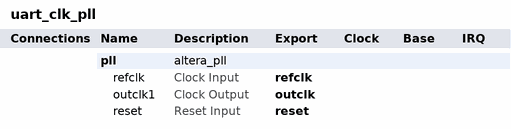
[diagram p0: system contents]
# Platform Designer (Qsys) system uart_clk_pll, Cyclone V 5CGXFC5C6F27C7
# Parameters at their usual value, and those the tool derives, are not listed.
package require -exact qsys 19.1
create_system uart_clk_pll
set_project_property DEVICE_FAMILY {Cyclone V}
set_project_property DEVICE 5CGXFC5C6F27C7

add_instance pll altera_pll 19.1
set_instance_parameter_value pll gui_device_speed_grade 1
set_instance_parameter_value pll gui_en_adv_params true
set_instance_parameter_value pll gui_number_of_clocks 2
set_instance_parameter_value pll gui_operation_mode direct
set_instance_parameter_value pll gui_output_clock_frequency0 43.2
set_instance_parameter_value pll gui_output_clock_frequency1 43.2
set_instance_parameter_value pll gui_pll_mode {Integer-N PLL}
set_instance_parameter_value pll gui_reference_clock_frequency 50.0
set_instance_parameter_value pll gui_use_locked false

# exported interfaces
add_interface outclk clock source
set_interface_property outclk EXPORT_OF pll.outclk1
add_interface refclk clock sink
set_interface_property refclk EXPORT_OF pll.refclk
add_interface reset reset sink
set_interface_property reset EXPORT_OF pll.reset

set_interconnect_requirement {$system} qsys_mm.clockCrossingAdapter HANDSHAKE
set_interconnect_requirement {$system} qsys_mm.enableEccProtection FALSE
set_interconnect_requirement {$system} qsys_mm.insertDefaultSlave FALSE
set_interconnect_requirement {$system} qsys_mm.maxAdditionalLatency 1

save_system uart_clk_pll.qsys
